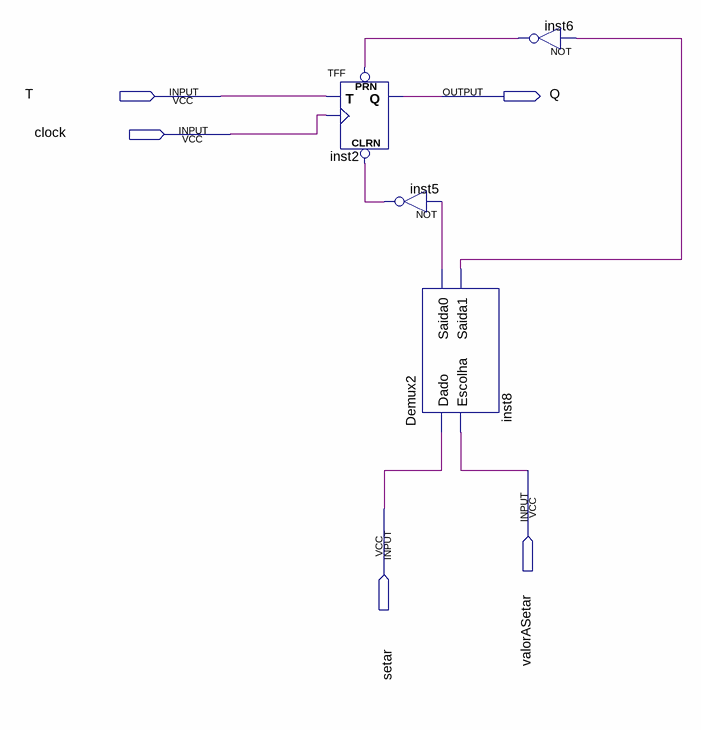
[diagram p0: schematic sheet]
// Quartus schematic fftComInicialiador.bdf as structural Verilog: 4 symbols, 5 pins
module fftComInicialiador (
  input  T,
  input  clock,
  input  valorASetar,
  input  setar,
  output Q
);

  wire inst5_out, inst6_out, inst8_saida0, inst8_saida1;

  TFF inst2 (.PRN(inst6_out), .CLRN(inst5_out), .T(T), .CLK(clock), .Q(Q));
  not inst5 (inst5_out, inst8_saida0);
  Demux2 inst8 (.Dado(setar), .Escolha(valorASetar), .Saida0(inst8_saida0), .Saida1(inst8_saida1));
  not inst6 (inst6_out, inst8_saida1);
endmodule
